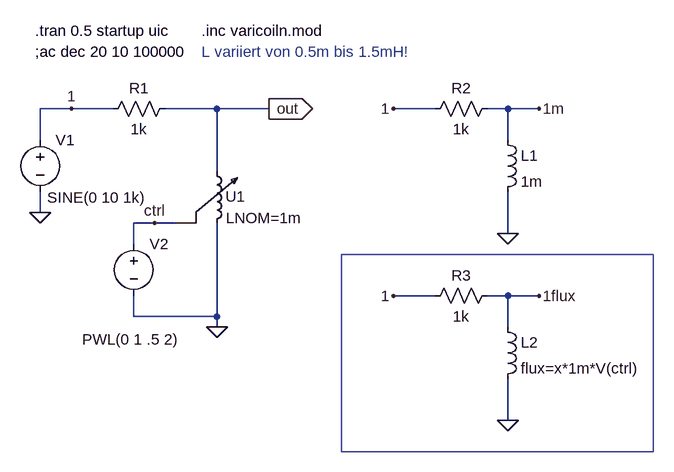
[diagram p0: schematic varicoiln_1mh.asc]
varicoiln_1mh.asc, the LTspice schematic file:
Version 4
SHEET 1 2056 680
WIRE -112 -112 -160 -112
WIRE -48 -112 -112 -112
WIRE 112 -112 32 -112
WIRE 192 -112 112 -112
WIRE 448 -112 384 -112
WIRE 560 -112 528 -112
WIRE 608 -112 560 -112
WIRE -160 -64 -160 -112
WIRE 560 -64 560 -112
WIRE 112 -16 112 -112
WIRE -160 48 -160 16
WIRE 16 64 -16 64
WIRE 48 64 16 64
WIRE 560 80 560 16
WIRE -16 96 -16 64
WIRE 448 176 384 176
WIRE 560 176 528 176
WIRE 608 176 560 176
WIRE -16 208 -16 176
WIRE 112 208 112 64
WIRE 112 208 -16 208
WIRE 112 224 112 208
WIRE 560 224 560 176
WIRE 560 368 560 304
FLAG 112 224 0
FLAG 192 -112 out
IOPIN 192 -112 Out
FLAG -160 48 0
FLAG -112 -112 1
FLAG 384 -112 1
FLAG 560 80 0
FLAG 608 -112 1m
FLAG 384 176 1
FLAG 560 368 0
FLAG 608 176 1flux
FLAG 16 64 ctrl
SYMBOL res 48 -128 R90
WINDOW 0 0 56 VBottom 0
WINDOW 3 32 56 VTop 0
SYMATTR InstName R1
SYMATTR Value 1k
SYMBOL voltage -160 -80 R0
WINDOW 3 162 105 Right 0
WINDOW 123 0 0 Left 0
WINDOW 39 0 0 Left 0
SYMATTR Value SINE(0 10 1k)
SYMATTR InstName V1
SYMBOL voltage -16 80 R0
WINDOW 3 70 163 Right 0
WINDOW 123 0 0 Left 0
WINDOW 39 0 0 Left 0
SYMATTR Value PWL(0 1 .5 2)
SYMATTR InstName V2
SYMBOL ind 544 -80 R0
SYMATTR InstName L1
SYMATTR Value 1m
SYMBOL res 544 -128 R90
WINDOW 0 0 56 VBottom 0
WINDOW 3 32 56 VTop 0
SYMATTR InstName R2
SYMATTR Value 1k
SYMBOL varicoiln 96 -32 R0
SYMATTR InstName U1
SYMATTR SpiceLine LNOM=1m
SYMBOL ind 544 208 R0
SYMATTR InstName L2
SYMATTR Value flux=x*1m*V(ctrl)
SYMBOL res 544 160 R90
WINDOW 0 0 56 VBottom 0
WINDOW 3 32 56 VTop 0
SYMATTR InstName R3
SYMATTR Value 1k
TEXT -168 -232 Left 0 !.tran 0.5 startup uic
TEXT 88 -232 Left 0 !.inc varicoiln.mod
TEXT -168 -200 Left 0 !;ac dec 20 10 100000
TEXT 88 -200 Left 0 ;L variiert von 0.5m bis 1.5mH!
RECTANGLE Normal 784 416 304 112

The netlist it stands for:
* varicoiln_1mh.asc
R1 out 1 1k
V1 1 0 SINE(0 10 1k)
V2 ctrl 0 PWL(0 1 .5 2)
L1 1m 0 1m
R2 1m 1 1k
XU1 out 0 ctrl VARICOILN LNOM=1m  ; pins A B CTRL
L2 1flux 0 flux=x*1m*V(ctrl)
R3 1flux 1 1k
.tran 0.5 startup uic
.inc varicoiln.mod
;ac dec 20 10 100000
* L variiert von 0.5m bis 1.5mH!
.backanno
.end